# EAGLE design Garden Solar Lights rev a (EAGLE 7.1.0)
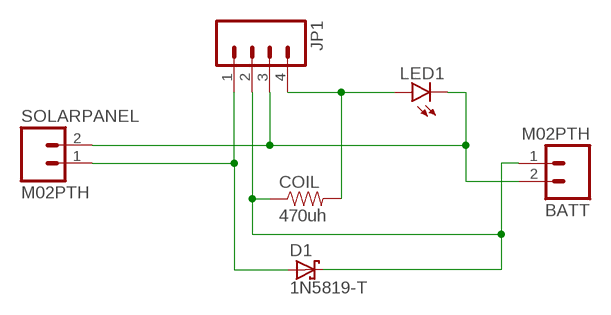
[diagram p0: schematic, sheet 1]

## Parts
BATT  M02PTH  [1X02]
COIL  470uh  RESISTORPTH-1/2W  [AXIAL-0.5]
D1  1N5819-T  [DO41-7.6]
JP1  M04PTH  [1X04]
LED1  LED3MM  [LED3MM]
SOLARPANEL  M02PTH  [1X02]

## Nets
N$1: D1.A JP1.1 SOLARPANEL.1
N$2: BATT.1 COIL.P$1 D1.C JP1.2
N$3: COIL.P$2 JP1.4 LED1.A
N$4: BATT.2 JP1.3 LED1.K(C) SOLARPANEL.2

## Library data of the parts
BATT SOLARPANEL = SparkFun-Connectors:M02: Standard 2-pin 0.1" header. Use with - straight break away headers ( PRT-00116) - right angle break away headers (PRT-00553) - swiss pins (PRT-00743) - machine pins (PRT-00117) - female headers (PRT-00115) Molex polarized connector foot print use with: PRT-08233 with associated crimp pins and housings. 2.54_SCREWTERM for use with PRT-10571. 3.5mm Screw Terminal footprints for PRT-08084 5mm Screw Terminal footprints for use with PRT-08432
COIL = SparkFun-Passives:RESISTOR: Resistor Basic schematic elements and footprints for 0603, 1206, and PTH resistors.
D1 = diode:1N581*: 1.0A SCHOTTKY BARRIER RECTIFIER Source: http://www.diodes.com/datasheets/ds23001.pdf
JP1 = SparkFun-Connectors:M04: Header 4 Standard 4-pin 0.1" header. Use with straight break away headers (SKU : PRT-00116), right angle break away headers (PRT-00553), swiss pins (PRT-00743), machine pins (PRT-00117), and female headers (PRT-00115). Molex polarized connector foot print use with SKU : PRT-08231 with associated crimp pins and housings. 1MM SMD Version SKU: PRT-10208
LED1 = SparkFun-LED:LED: LEDs Standard schematic elements and footprints for 5mm, 3mm, 1206, and 0603 sized LEDs. 5mm - Spark Fun Electronics SKU : COM-00529 (and others)

## Board
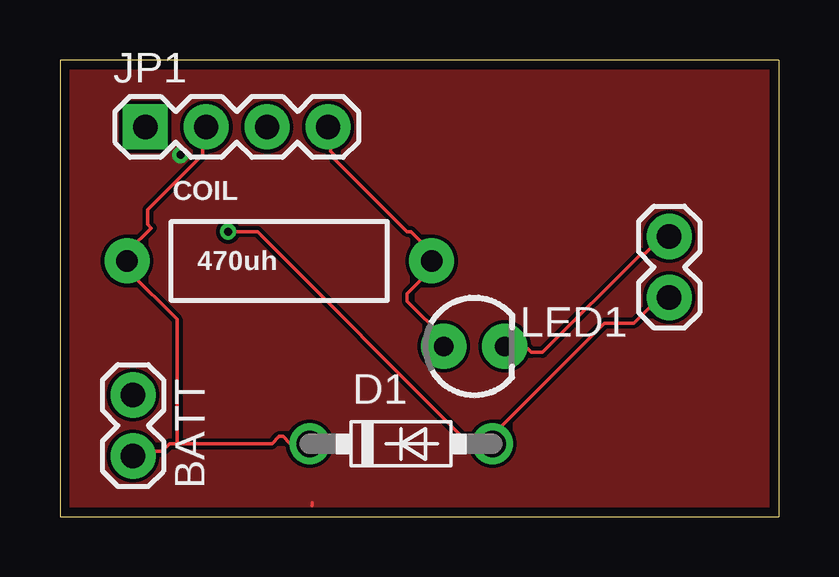
[diagram p1: board, top side]
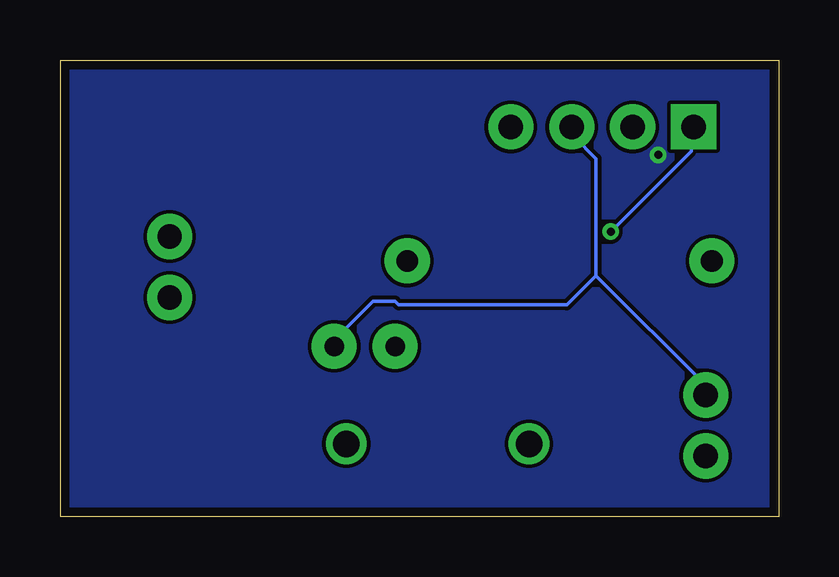
[diagram p2: board, bottom side, seen from below]

Size 29.97 x 19.04 mm. Coordinates in mm from the lower left corner, seen from the top.
Outline: 0,0 29.97,0 29.97,19.04 0,19.04 0,0
Copper layers (1*16): Top 0.0356mm / dielectric 1.5011mm / Bottom 0.0356mm
Design rules "LaenPCBOrder": minimum track width 6mil, minimum drill 13mil, track to track 6mil, track to pad 6mil, pad to pad 6mil, via to via 6mil, smd to smd 6mil, copper to edge 15mil, drill to drill 6mil, minimum pad ring 7mil, minimum via ring 7mil, stop-mask expansion 3mil, vias tented up to drill 0mil, thermal gap 10mil

### Footprints (pad centres in the part's own frame; a part is rotated, then mirrored left to right if it is on the bottom)
1X02 = drill 1.016 pad 1.88: 1 0,0; 2 2.54,0
AXIAL-0.5 = drill 0.9 pad 1.88: P$1 -6.35,0; P$2 6.35,0
DO41-7.6 = drill 1.1 pad 1.7: A 3.81,0; C -3.81,0
1X04 = drill 1.016 pad 1.88 square: 1 0,0 | drill 1.016 pad 1.88: 2 2.54,0; 3 5.08,0; 4 7.62,0
LED3MM = drill 0.813 pad 1.88: A -1.27,0; K 1.27,0

### Placement (x,y rotation side)
BATT  3.05,2.54 90 top
COIL  9.14,10.67 0 top
D1  14.22,3.05 0 top
JP1  3.56,16.26 0 top
LED1  17.27,7.11 0 top
SOLARPANEL  25.4,9.14 90 top

### Tracks (layer width: path | path; a pad name or v marks a point on that pad's centre or on a via)
GND  (via drill 0.33)
  Top 0.152: 10.52,0.46 10.52,0.58
  other vias: 5.03,15.09
  pour Top: -14.22,23.37 80.26,21.34 80.26,-3.56 -13.72,-2.54
  pour Bottom: -14.22,-3.56 80.77,-4.06 80.26,22.35 -14.22,23.88
N$1  (via drill 0.33)
  Top 0.152: SOLARPANEL.1 24.99,9.14 23.93,8.08 22.71,8.08 18.14,3.5 18.14,3.05 D1.A 17.22,3.05 17.07,3.2 16.92,3.2 8.23,11.89 v7.01,11.89
  Bottom 0.152: v7.01,11.89 3.66,15.24 3.66,16.15 JP1.1
N$2
  Top 0.152: D1.C 9.6,3.05 9.3,3.35 9.14,3.35 8.84,3.05 4.88,3.05 | 4.88,3.05 4.57,3.05 4.27,2.74 3.2,2.74 3.05,2.59 BATT.1 | 2.9,10.67 2.9,11.12 3.81,12.04 3.66,12.19 3.66,12.8 5.94,15.09 5.94,16 6.1,16.15 JP1.2 | 4.88,3.05 4.88,8.23 2.9,10.21 2.9,10.67 | 2.9,10.67 COIL.P$1
N$3
  Top 0.152: LED1.A 16,7.47 14.48,8.99 14.48,9.3 15.39,10.21 15.39,10.67 | 15.39,10.67 15.39,11.12 14.63,11.89 14.48,11.89 11.43,14.94 11.43,15.09 11.28,15.24 11.28,16.15 JP1.4 | 15.39,10.67 COIL.P$2
N$4
  Top 0.152: LED1.K 18.59,7.01 19.51,7.01 19.66,6.86 20.12,6.86 24.23,10.97 24.38,10.97 24.99,11.58 25.3,11.58 SOLARPANEL.2
  Bottom 0.152: BATT.2 3.05,5.49 7.62,10.06 | 7.62,10.06 7.62,14.94 8.53,15.85 8.53,16.15 JP1.3 | 7.62,10.06 8.84,8.84 15.85,8.84 16,8.99 16.92,8.99 18.44,7.47 18.44,7.16 LED1.K